# EAGLE board DM04ttl (EAGLE 6.6.0), part 1 of 3
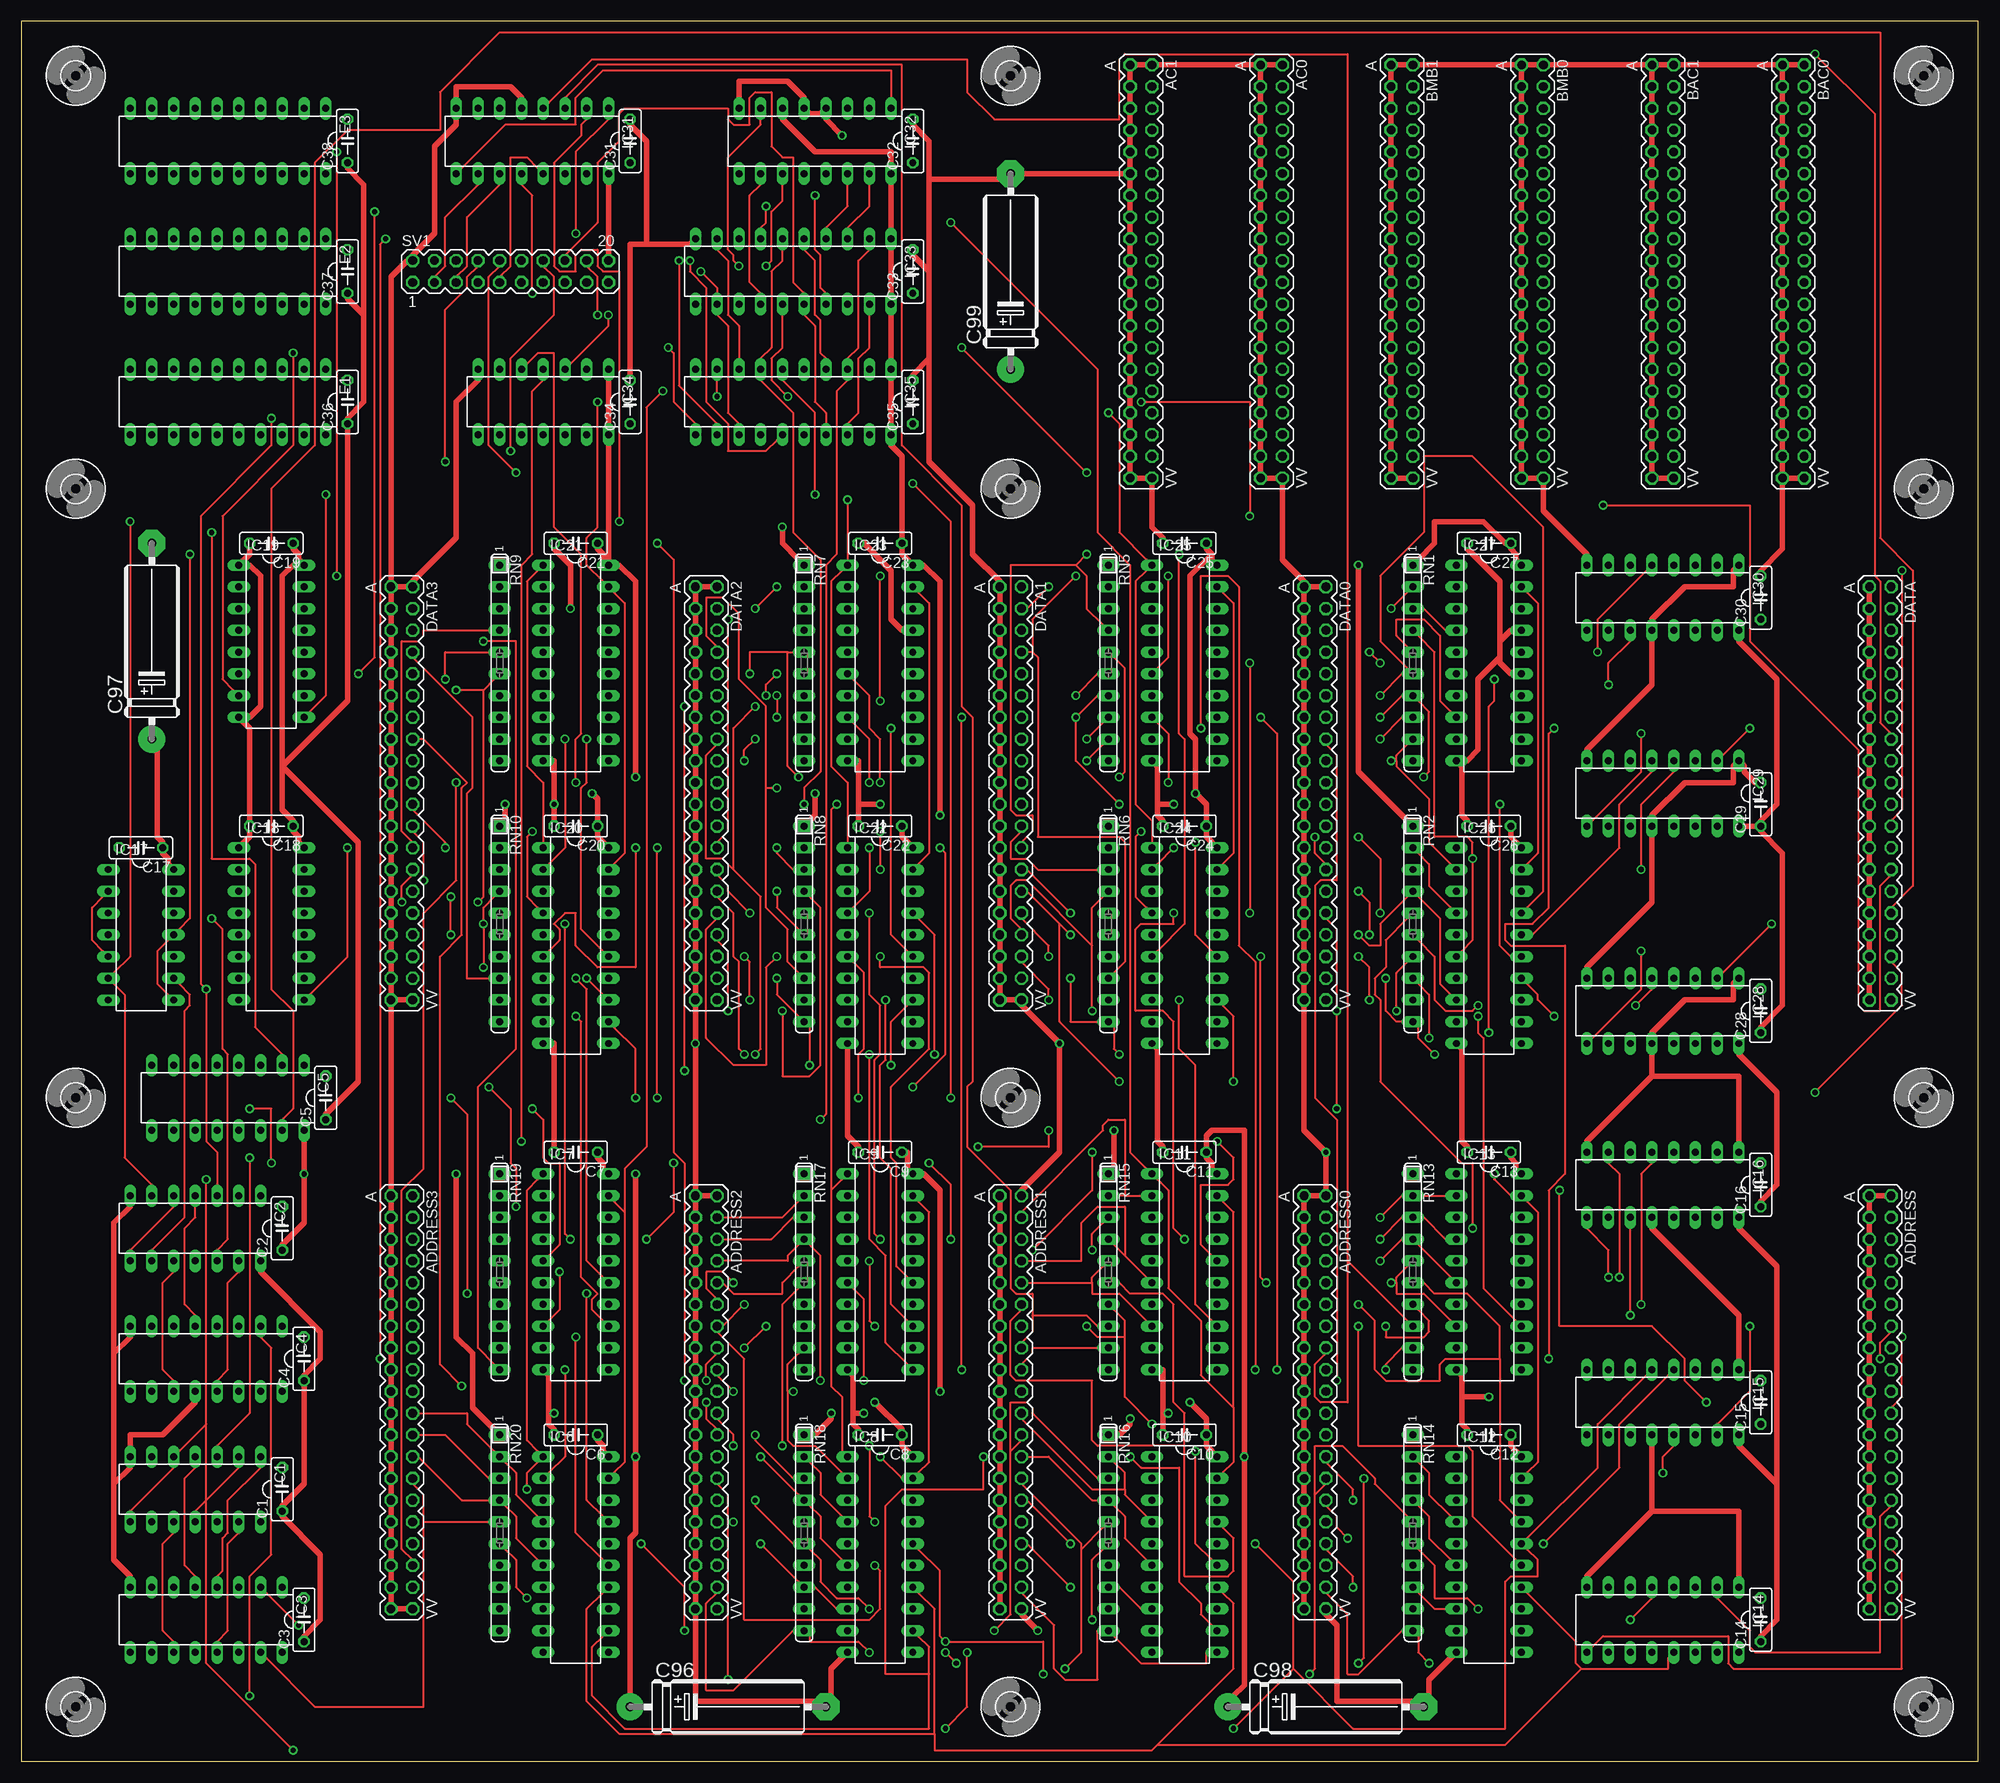
[diagram p6: board, top side]
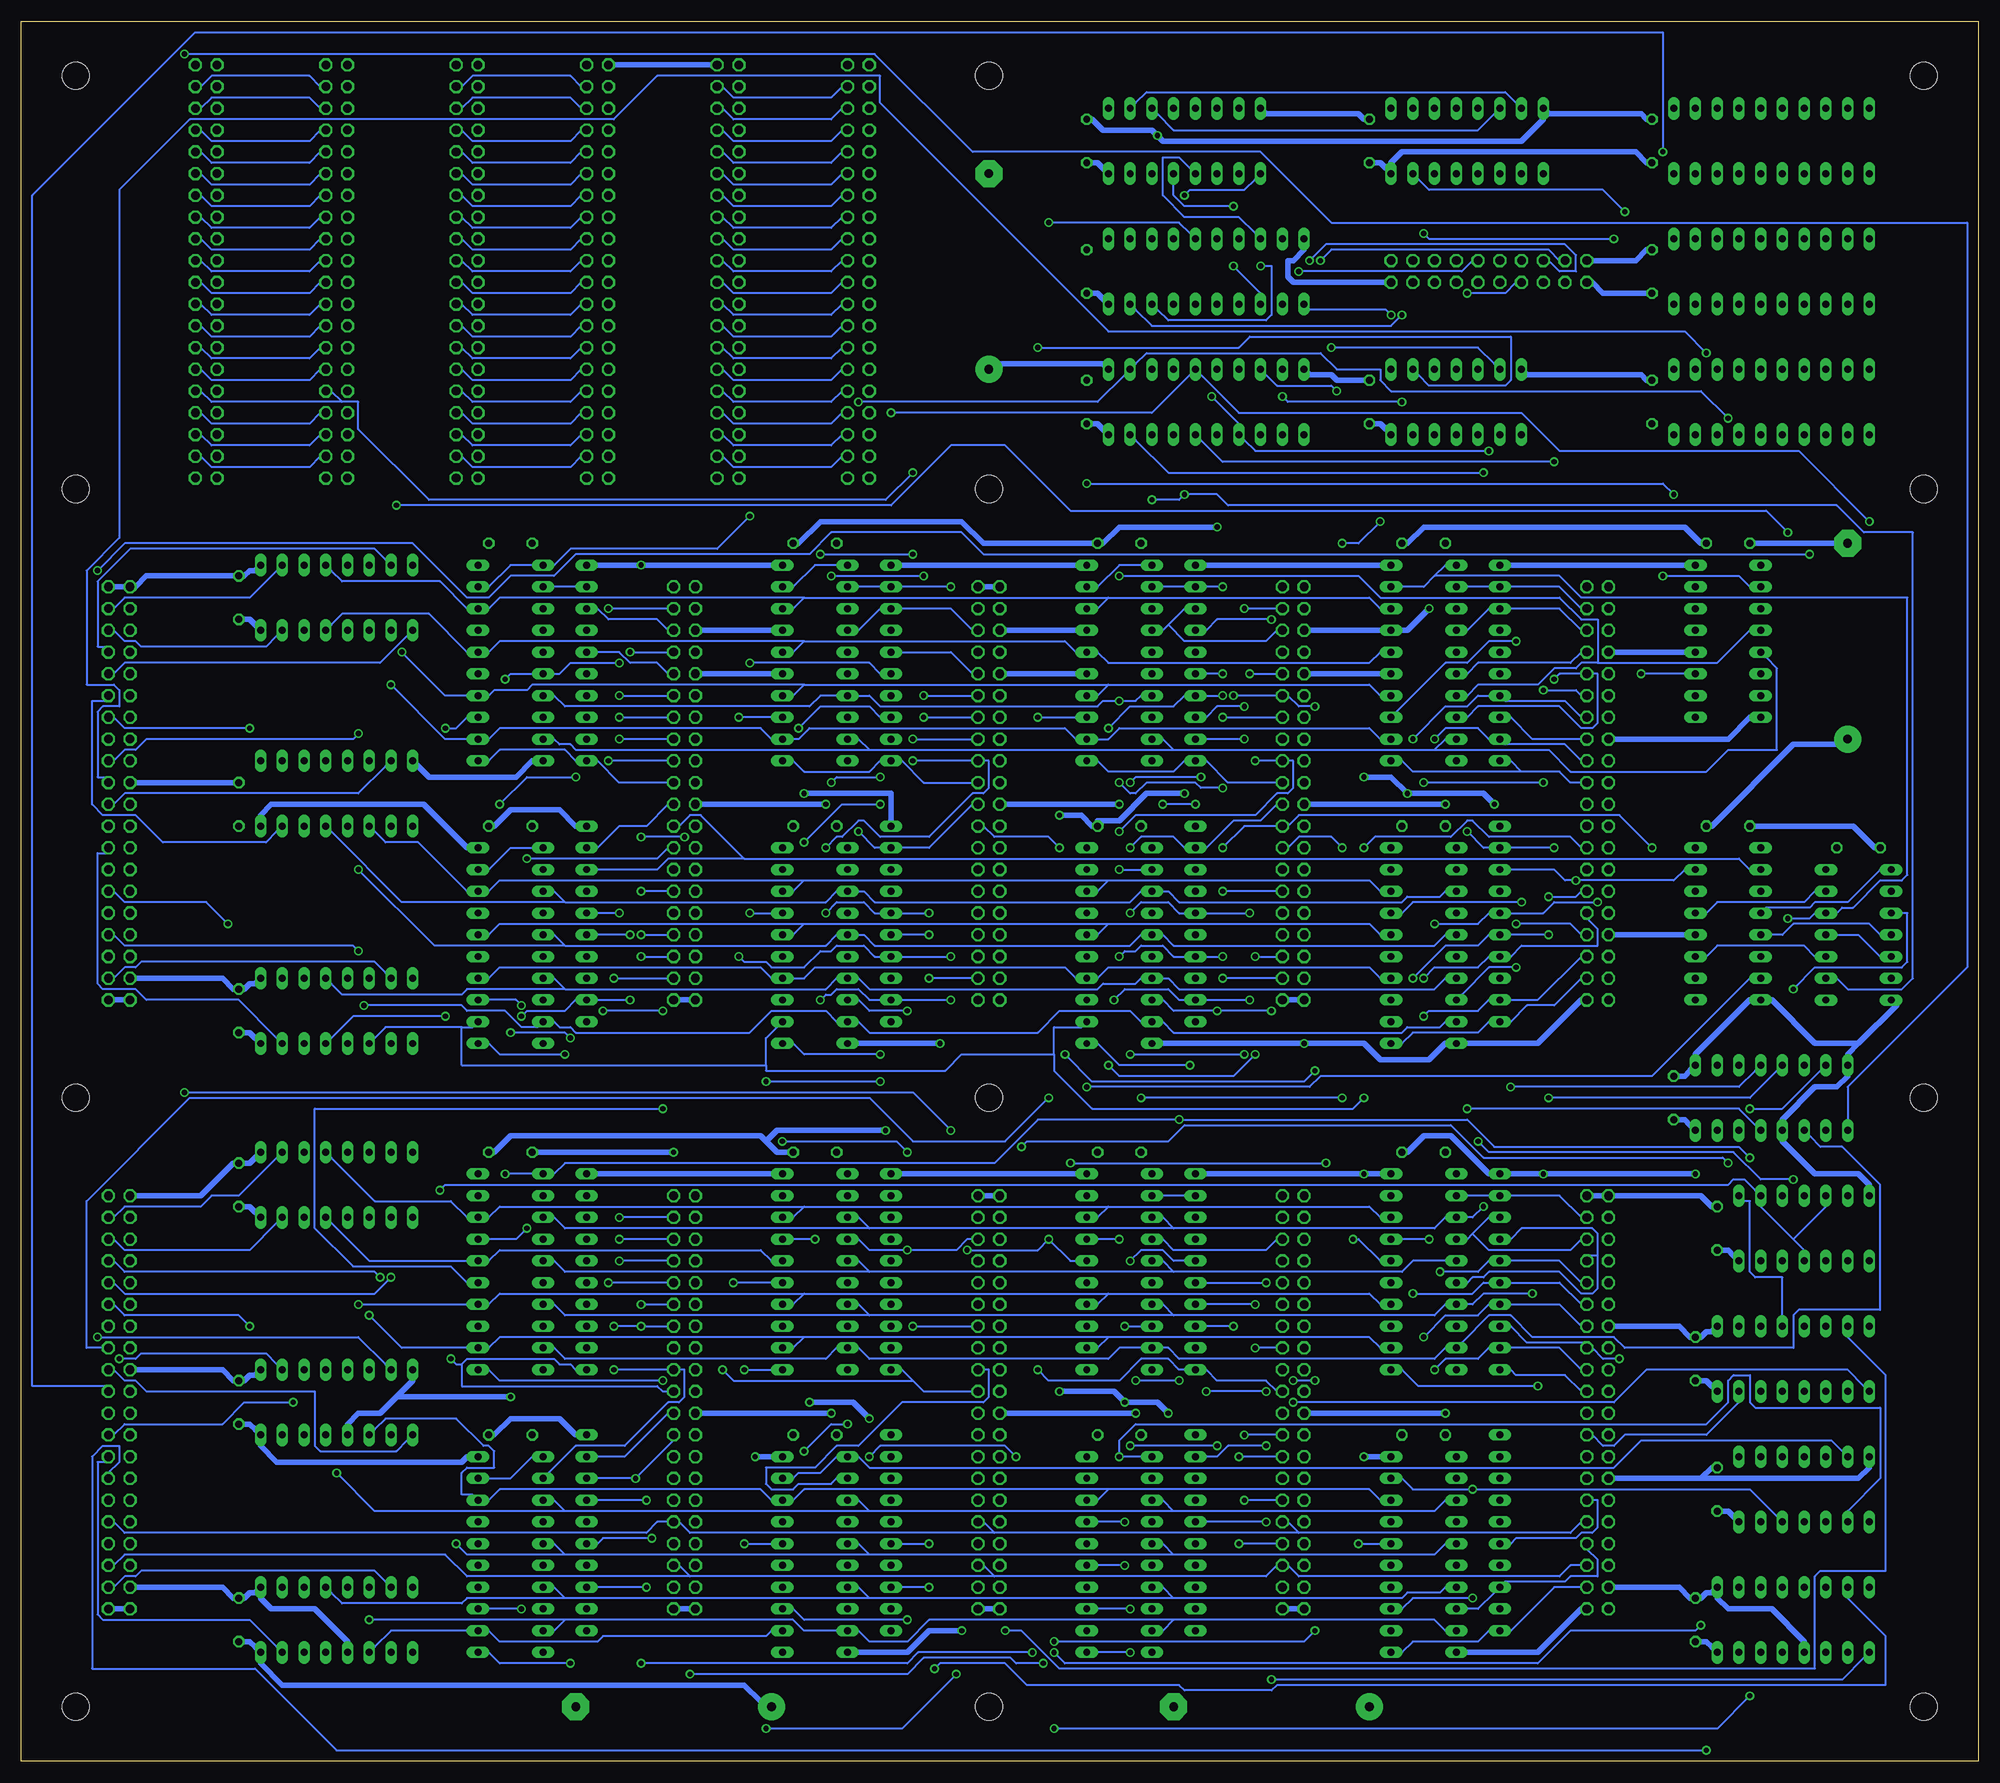
[diagram p7: board, bottom side, seen from below]

Size 228.6 x 203.2 mm. Coordinates in mm from the lower left corner, seen from the top.
Outline: 0,0 228.6,0 228.6,203.2 0,203.2 0,0
Copper layers (1*16): Top 0.035mm / dielectric 1.5mm / Bottom 0.035mm
Design rules "10mils": minimum track width 10mil, minimum drill 24mil, track to track 10mil, track to pad 10mil, pad to pad 10mil, via to via 10mil, smd to smd 10mil, copper to edge 25mil, drill to drill 10mil, minimum pad ring 10mil, minimum via ring 8mil, stop-mask expansion 0mil, vias tented up to drill 0mil, thermal gap 10mil
Net classes: 1 Supply: width 0.635 mm, clearance 0.381 mm

## Footprints (pad centres in the part's own frame; a part is rotated, then mirrored left to right if it is on the bottom)
DEC40PINV = drill 1.016 octagon: A -24.13,-1.27; AA 3.81,-1.27; B -24.13,1.27; BB 3.81,1.27; C -21.59,-1.27; CC 6.35,-1.27; D -21.59,1.27; DD 6.35,1.27; E -19.05,-1.27; EE 8.89,-1.27; F -19.05,1.27; FF 8.89,1.27; H -16.51,-1.27; HH 11.43,-1.27; J -16.51,1.27; JJ 11.43,1.27; K -13.97,-1.27; KK 13.97,-1.27; L -13.97,1.27; LL 13.97,1.27; M -11.43,-1.27; MM 16.51,-1.27; N -11.43,1.27; NN 16.51,1.27; P -8.89,-1.27; PP 19.05,-1.27; R -8.89,1.27; RR 19.05,1.27; S -6.35,-1.27; SS 21.59,-1.27; T -6.35,1.27; TT 21.59,1.27; U -3.81,-1.27; UU 24.13,-1.27; V -3.81,1.27; VV 24.13,1.27; W -1.27,-1.27; X -1.27,1.27; Y 1.27,-1.27; Z 1.27,1.27
C050-025X075 = drill 0.813 octagon: 1 -2.54,0; 2 2.54,0
E22-6 = drill 1.016 pad 3.15: + -11.43,0 | drill 1.016 pad 3.15 octagon: - 11.43,0
DIL20 = drill 0.813 long: 1 -11.43,-3.81; 2 -8.89,-3.81; 3 -6.35,-3.81; 4 -3.81,-3.81; 5 -1.27,-3.81; 6 1.27,-3.81; 7 3.81,-3.81; 8 6.35,-3.81; 9 8.89,-3.81; 10 11.43,-3.81; 11 11.43,3.81; 12 8.89,3.81; 13 6.35,3.81; 14 3.81,3.81; 15 1.27,3.81; 16 -1.27,3.81; 17 -3.81,3.81; 18 -6.35,3.81; 19 -8.89,3.81; 20 -11.43,3.81
DIL14 = drill 0.813 long: 1 -7.62,-3.81; 2 -5.08,-3.81; 3 -2.54,-3.81; 4 0,-3.81; 5 2.54,-3.81; 6 5.08,-3.81; 7 7.62,-3.81; 8 7.62,3.81; 9 5.08,3.81; 10 2.54,3.81; 11 0,3.81; 12 -2.54,3.81; 13 -5.08,3.81; 14 -7.62,3.81
DIL16 = drill 0.813 long: 1 -8.89,-3.81; 2 -6.35,-3.81; 3 -3.81,-3.81; 4 -1.27,-3.81; 5 1.27,-3.81; 6 3.81,-3.81; 7 6.35,-3.81; 8 8.89,-3.81; 9 8.89,3.81; 10 6.35,3.81; 11 3.81,3.81; 12 1.27,3.81; 13 -1.27,3.81; 14 -3.81,3.81; 15 -6.35,3.81; 16 -8.89,3.81
SIL10 = drill 0.813 long: 1 -11.43,0; 2 -8.89,0; 3 -6.35,0; 4 -3.81,0; 5 -1.27,0; 6 1.27,0; 7 3.81,0; 8 6.35,0; 9 8.89,0; 10 11.43,0
MA10-2 = drill 1.016 octagon: 1 -11.43,-1.27; 2 -11.43,1.27; 3 -8.89,-1.27; 4 -8.89,1.27; 5 -6.35,-1.27; 6 -6.35,1.27; 7 -3.81,-1.27; 8 -3.81,1.27; 9 -1.27,-1.27; 10 -1.27,1.27; 11 1.27,-1.27; 12 1.27,1.27; 13 3.81,-1.27; 14 3.81,1.27; 15 6.35,-1.27; 16 6.35,1.27; 17 8.89,-1.27; 18 8.89,1.27; 19 11.43,-1.27; 20 11.43,1.27
3,2 = hole 3.2: 0,0

## Placement (x,y rotation side)
AC0  BC08J  [DEC40PINV]  146.05,173.99 270 top
AC1  BC08J  [DEC40PINV]  130.81,173.99 270 top
ADDRESS  BC08J  [DEC40PINV]  217.17,41.91 270 top
ADDRESS0  BC08J  [DEC40PINV]  151.13,41.91 270 top
ADDRESS1  BC08J  [DEC40PINV]  115.57,41.91 270 top
ADDRESS2  BC08J  [DEC40PINV]  80.01,41.91 270 top
ADDRESS3  BC08J  [DEC40PINV]  44.45,41.91 270 top
BAC0  BC08J  [DEC40PINV]  207.01,173.99 270 top
BAC1  BC08J  [DEC40PINV]  191.77,173.99 270 top
BMB0  BC08J  [DEC40PINV]  176.53,173.99 270 top
BMB1  BC08J  [DEC40PINV]  161.29,173.99 270 top
C1  .1uf  [C050-025X075]  30.48,31.75 90 top
C2  .1uf  [C050-025X075]  30.48,62.23 90 top
C3  .1uf  [C050-025X075]  33.02,16.51 90 top
C4  .1uf  [C050-025X075]  33.02,46.99 90 top
C5  .1uf  [C050-025X075]  35.56,77.47 90 top
C6  .1uf  [C050-025X075]  64.77,38.1 180 top
C7  .1uf  [C050-025X075]  64.77,71.12 180 top
C8  .1uf  [C050-025X075]  100.33,38.1 180 top
C9  .1uf  [C050-025X075]  100.33,71.12 180 top
C10  .1uf  [C050-025X075]  135.89,38.1 180 top
C11  .1uf  [C050-025X075]  135.89,71.12 180 top
C12  .1uf  [C050-025X075]  171.45,38.1 180 top
C13  .1uf  [C050-025X075]  171.45,71.12 180 top
C14  .1uf  [C050-025X075]  203.2,16.51 90 top
C15  .1uf  [C050-025X075]  203.2,41.91 90 top
C16  .1uf  [C050-025X075]  203.2,67.31 90 top
C17  .1uf  [C050-025X075]  13.97,106.68 180 top
C18  .1uf  [C050-025X075]  29.21,109.22 180 top
C19  .1uf  [C050-025X075]  29.21,142.24 180 top
C20  .1uf  [C050-025X075]  64.77,109.22 180 top
C21  .1uf  [C050-025X075]  64.77,142.24 180 top
C22  .1uf  [C050-025X075]  100.33,109.22 180 top
C23  .1uf  [C050-025X075]  100.33,142.24 180 top
C24  .1uf  [C050-025X075]  135.89,109.22 180 top
C25  .1uf  [C050-025X075]  135.89,142.24 180 top
C26  .1uf  [C050-025X075]  171.45,109.22 180 top
C27  .1uf  [C050-025X075]  171.45,142.24 180 top
C28  .1uf  [C050-025X075]  203.2,87.63 90 top
C29  .1uf  [C050-025X075]  203.2,111.76 90 top
C30  .1uf  [C050-025X075]  203.2,135.89 90 top
C31  .1uf  [C050-025X075]  71.12,189.23 90 top
C32  .1uf  [C050-025X075]  104.14,189.23 90 top
C33  .1uf  [C050-025X075]  104.14,173.99 90 top
C34  .1uf  [C050-025X075]  71.12,158.75 90 top
C35  .1uf  [C050-025X075]  104.14,158.75 90 top
C36  .1uf  [C050-025X075]  38.1,158.75 90 top
C37  .1uf  [C050-025X075]  38.1,173.99 90 top
C38  .1uf  [C050-025X075]  38.1,189.23 90 top
C96  100uf  [E22-6]  82.55,6.35 0 top
C97  100uf  [E22-6]  15.24,130.81 90 top
C98  100uf  [E22-6]  152.4,6.35 0 top
C99  100uf  [E22-6]  115.57,173.99 90 top
DATA  BC08J  [DEC40PINV]  217.17,113.03 270 top
DATA0  BC08J  [DEC40PINV]  151.13,113.03 270 top
DATA1  BC08J  [DEC40PINV]  115.57,113.03 270 top
DATA2  BC08J  [DEC40PINV]  80.01,113.03 270 top
DATA3  BC08J  [DEC40PINV]  44.45,113.03 270 top
E1  [DIL20]  24.13,158.75 180 top
E2  [DIL20]  24.13,173.99 180 top
E3  [DIL20]  24.13,189.23 180 top
IC1  74S02N  [DIL14]  20.32,31.75 180 top
IC2  74S02N  [DIL14]  20.32,62.23 180 top
IC3  AM26S10  [DIL16]  21.59,16.51 180 top
IC4  AM26S10  [DIL16]  21.59,46.99 180 top
IC5  AM26S10  [DIL16]  24.13,77.47 180 top
IC6  74S240N  [DIL20]  64.77,24.13 270 top
IC7  74S240N  [DIL20]  64.77,57.15 270 top
IC8  74S240N  [DIL20]  100.33,24.13 270 top
IC9  74S240N  [DIL20]  100.33,57.15 270 top
IC10  74S240N  [DIL20]  135.89,24.13 270 top
IC11  74S240N  [DIL20]  135.89,57.15 270 top
IC12  74S240N  [DIL20]  171.45,24.13 270 top
IC13  74S240N  [DIL20]  171.45,57.15 270 top
IC14  AM26S10  [DIL16]  191.77,16.51 180 top
IC15  AM26S10  [DIL16]  191.77,41.91 180 top
IC16  AM26S10  [DIL16]  191.77,67.31 180 top
IC17  74S02N  [DIL14]  13.97,96.52 270 top
IC18  AM26S10  [DIL16]  29.21,97.79 270 top
IC19  AM26S10  [DIL16]  29.21,130.81 270 top
IC20  74S240N  [DIL20]  64.77,95.25 270 top
IC21  74S240N  [DIL20]  64.77,128.27 270 top
IC22  74S240N  [DIL20]  100.33,95.25 270 top
IC23  74S240N  [DIL20]  100.33,128.27 270 top
IC24  74S240N  [DIL20]  135.89,95.25 270 top
IC25  74S240N  [DIL20]  135.89,128.27 270 top
IC26  74S240N  [DIL20]  171.45,95.25 270 top
IC27  74S240N  [DIL20]  171.45,128.27 270 top
IC28  AM26S10  [DIL16]  191.77,87.63 180 top
IC29  AM26S10  [DIL16]  191.77,113.03 180 top
IC30  AM26S10  [DIL16]  191.77,135.89 180 top
IC31  74LS148N  [DIL16]  59.69,189.23 180 top
IC32  74S138N  [DIL16]  92.71,189.23 180 top
IC33  74273N  [DIL20]  90.17,173.99 180 top
IC34  74S86N  [DIL14]  60.96,158.75 180 top
IC35  74273N  [DIL20]  90.17,158.75 180 top
RN1  [SIL10]  162.56,128.27 270 top
RN2  [SIL10]  162.56,97.79 270 top
RN5  [SIL10]  127,128.27 270 top
RN6  [SIL10]  127,97.79 270 top
RN7  [SIL10]  91.44,128.27 270 top
RN8  [SIL10]  91.44,97.79 270 top
RN9  [SIL10]  55.88,128.27 270 top
RN10  [SIL10]  55.88,97.79 270 top
RN13  [SIL10]  162.56,57.15 270 top
RN14  [SIL10]  162.56,26.67 270 top
RN15  [SIL10]  127,57.15 270 top
RN16  [SIL10]  127,26.67 270 top
RN17  [SIL10]  91.44,57.15 270 top
RN18  [SIL10]  91.44,26.67 270 top
RN19  [SIL10]  55.88,57.15 270 top
RN20  [SIL10]  55.88,26.67 270 top
SV1  [MA10-2]  57.15,173.99 0 top
U$1  [3,2]  222.25,6.35 270 top
U$2  [3,2]  6.35,196.85 270 top
U$3  [3,2]  222.25,196.85 270 top
U$4  [3,2]  6.35,6.35 270 top
U$5  [3,2]  115.57,196.85 270 top
U$6  [3,2]  115.57,77.47 270 top
U$7  [3,2]  222.25,148.59 270 top
U$8  [3,2]  222.25,77.47 270 top
U$9  [3,2]  6.35,77.47 270 top
U$10  [3,2]  6.35,148.59 270 top
U$11  [3,2]  115.57,6.35 270 top
U$12  [3,2]  115.57,148.59 270 top

## Tracks (layer width: path | path; a pad name or v marks a point on that pad's centre or on a via)
1-CA_INH
  Bottom 0.254: 63.5,118.11 62.23,119.38 IC21.9 | 93.98,118.11 63.5,118.11 | 93.98,118.11 95.25,119.38 IC23.9 | 63.5,118.11 50.16,118.11 47.62,115.57 31.75,115.57 29.21,118.11 23.5,118.11 23.5,127.64 24.77,128.91 IC19.5 | 129.54,118.11 130.81,119.38 IC25.9 | 129.54,118.11 93.98,118.11 | 129.54,118.11 163.83,118.11 164.47,118.75 165.74,118.75 166.37,119.38 IC27.9
3CYCLE
  Bottom 0.254: IC13.9 166.37,48.26 165.1,46.99 134.62,46.99 133.35,48.26 IC11.9 130.81,48.26 129.54,46.99 101.6,46.99 100.33,48.26 97.79,48.26 IC9.9 95.25,48.26 94.61,48.26 93.34,46.99 63.5,46.99 62.23,48.26 IC7.9 60.33,48.9 57.15,52.07 54.61,52.07 52.07,49.53 42.55,49.53 41.27,48.26 21.59,48.26 21.59,52.07 20.95,52.7 11.43,52.7 11.43,67.31 15.88,71.75 18.41,71.75 19.68,73.03 IC5.11
!1-CA_INH  (via drill 0.61)
  Top 0.254: v31.75,164.47 31.75,153.67 23.5,145.41 23.5,126.36 24.77,125.09 IC19.7
  Bottom 0.254: v31.75,164.47 34.29,167 101.6,167 128.27,193.68 128.27,196.85 154.31,196.85 159.38,191.77 208.91,191.77 217.17,183.51 217.17,142.88 220.98,139.06 220.98,125.73 217.81,125.73 217.17,125.09 217.17,123.19 219.07,123.19 219.71,122.56 219.71,114.94 218.44,114.94 DATA.X
!1-CA_INH0
  Bottom 0.254: DATA0.X 153.03,114.3 158.75,114.3 161.29,116.84 RN1.10 163.83,116.84 165.1,118.11 172.72,118.11 173.99,116.84 IC27.11
!1-CA_INH1
  Bottom 0.254: DATA1.X 117.47,114.3 123.19,114.3 125.73,116.84 RN5.10 128.27,116.84 129.54,115.57 137.16,115.57 138.43,116.84 IC25.11
!1-CA_INH2
  Bottom 0.254: DATA2.X 81.92,114.3 87.63,114.3 90.17,116.84 RN7.10 92.71,116.84 93.98,115.57 101.6,115.57 102.87,116.84 IC23.11
!1-CA_INH3
  Bottom 0.254: 53.34,115.57 54.61,116.84 RN9.10 | 53.34,115.57 48.9,115.57 47.62,114.3 46.35,114.3 DATA3.X | 53.34,115.57 66.04,115.57 67.31,116.84 IC21.11
!3CYCLE  (via drill 0.61)
  Top 0.254: v209.55,199.39 216.53,192.41 216.53,138.43 217.17,137.79 217.17,121.28 218.44,120.02 DATA.T
  Bottom 0.254: v209.55,199.39 128.91,199.39 117.47,187.96 83.82,187.96 75.56,179.71 1.27,179.71 1.27,92.71 15.24,78.74 15.24,74.93 IC5.9
!3CYCLE0  (via drill 0.61)
  Top 0.254: v158.75,119.38 161.29,121.92 RN1.8 | v153.67,44.45 153.67,74.93 151.13,77.47 151.13,102.23 151.76,102.87 153.67,102.87 153.67,117.47 152.4,118.75 DATA0.T
  Bottom 0.254: v158.75,119.38 153.03,119.38 DATA0.T | v153.67,44.45 172.72,44.45 173.99,45.72 IC13.11
!3CYCLE1  (via drill 0.61)
  Top 0.254: v144.15,45.72 144.15,93.34 142.24,95.25 142.24,137.16 140.97,138.43 137.79,138.43 v137.79,120.65 | v124.46,119.38 126.36,121.28 RN5.8
  Bottom 0.254: v144.15,45.72 140.97,45.72 IC11.11 | v137.79,120.65 135.25,123.19 129.54,123.19 128.27,121.92 RN5.8 | v124.46,119.38 117.47,119.38 DATA1.T
!3CYCLE2  (via drill 0.61)
  Top 0.254: v99.06,82.55 99.06,60.96 100.97,59.05 100.97,48.9 103.5,46.35 IC9.11 | v85.72,82.55 86.36,83.19 86.36,100.97 83.19,104.14 | 83.19,104.14 81.92,105.41 80.01,105.41 80.01,117.47 81.28,118.75 DATA2.T | v85.72,123.19 83.19,120.65 83.19,104.14
  Bottom 0.254: v99.06,82.55 v85.72,82.55 | v85.72,123.19 88.9,123.19 90.17,121.92 RN7.8
!3CYCLE3  (via drill 0.61)
  Top 0.254: v51.44,43.81 48.9,46.35 48.9,93.98 51.44,96.52 51.44,113.67 52.07,114.3 46.99,119.38 46.35,119.38 DATA3.T
  Bottom 0.254: v51.44,43.81 65.41,43.81 67.31,45.72 IC7.11 | RN9.8 54.61,121.92 52.07,119.38 46.35,119.38 DATA3.T
!A_EN0  (via drill 0.61)
  Top 0.254: IC12.19 175.9,33.66 177.16,34.92 177.16,64.14 175.9,65.41 IC13.19 173.99,66.04 172.09,67.94 v172.09,68.58 | IC33.2 99.06,176.53 97.79,175.26 97.79,165.1 96.52,163.83 IC35.3 96.52,161.29 95.25,160.02 95.25,140.97 93.98,139.7 93.98,75.56 v93.34,74.93 | v26.67,70.48 26.67,40.64 22.86,36.83 IC1.3
  Bottom 0.254: IC12.1 168.91,35.56 171.45,33.02 173.99,33.02 IC12.19 | v26.67,70.48 27.94,71.75 56.52,71.75 59.69,74.93 v93.34,74.93 109.86,74.93 114.94,69.85 165.1,69.85 166.37,68.58 IC13.1 168.91,68.58 v172.09,68.58
!A_EN1  (via drill 0.61)
  Top 0.254: IC35.4 93.98,163.83 93.34,164.47 93.34,168.28 92.71,168.91 92.71,175.26 91.44,176.53 IC33.5 | 141.6,41.27 141.6,34.92 140.34,33.66 IC10.19 | 141.6,41.27 141.6,64.14 140.34,65.41 IC11.19 | 141.6,41.27 137.79,45.09 137.79,51.44 133.99,55.24 133.99,66.67 132.72,67.94 IC11.1 131.44,69.22 129.54,71.12 129.54,139.7 125.73,143.51 125.73,162.56 v108.58,179.71
  Bottom 0.254: IC1.6 15.88,36.2 17.14,37.47 39.37,37.47 42.55,34.29 129.54,34.29 130.81,35.56 IC10.1 133.35,35.56 135.25,33.66 137.79,33.66 138.43,33.02 IC10.19 | v108.58,179.71 93.34,179.71 92.08,178.44 IC33.5
!A_EN2  (via drill 0.61)
  Top 0.254: IC9.19 104.78,65.41 106.05,64.14 106.05,34.92 104.78,33.66 IC8.19 102.87,33.02 v100.33,35.56 | IC33.6 88.9,176.53 88.9,175.26 87.63,173.99 87.63,165.1 86.36,163.83 IC35.7 86.36,161.29 90.17,157.48 90.17,143.51 93.34,140.34 93.34,115.57 91.44,113.67 v91.44,111.76 | 94.61,66.67 95.89,67.94 IC9.1 | 94.61,66.67 94.61,43.81 95.89,42.55 95.89,36.2 IC8.1 | v95.25,111.76 94.61,111.12 94.61,66.67
  Bottom 0.254: IC1.9 15.24,29.21 11.43,33.02 11.43,41.27 26.04,41.27 26.67,41.91 26.67,45.09 28.57,45.09 29.21,44.45 29.21,41.91 31.75,39.37 98.42,39.37 100.33,37.47 v100.33,35.56 97.79,35.56 IC8.1 | v91.44,111.76 v95.25,111.76
!A_EN3  (via drill 0.61)
  Top 0.254: IC7.1 60.33,67.94 59.05,66.67 59.05,37.47 60.33,36.2 IC6.1 60.33,34.92 59.05,33.66 v59.05,31.75 | IC33.9 81.28,176.53 82.55,175.26 82.55,168.91 83.82,167.64 83.82,163.83 IC35.8 | 70.48,64.14 69.22,65.41 IC7.19 | 70.48,64.14 70.48,34.92 69.22,33.66 IC6.19 | v74.93,160.02 73.03,158.12 73.03,71.75 70.48,69.22 70.48,64.14
  Bottom 0.254: IC1.12 23.5,28.57 26.67,31.75 v59.05,31.75 66.04,31.75 67.31,33.02 IC6.19 | v74.93,160.02 75.56,160.66 81.92,160.66 83.19,161.93 IC35.8
!A_EN4  (via drill 0.61)
  Top 0.254: IC35.13 83.82,156.21 82.55,157.48 82.55,167.64 81.28,168.91 IC33.12 81.28,171.45 81.28,172.09 v79.38,173.99
  Bottom 0.254: v79.38,173.99 60.33,173.99 59.05,175.26 SV1.12
!A_EN5  (via drill 0.61)
  Top 0.254: v89.53,159.38 87.63,161.29 87.63,163.83 88.9,165.1 88.9,168.91 IC33.15 | v57.15,153.03 57.15,163.83 62.23,168.91 62.23,173.35 60.96,174.62 SV1.14
  Bottom 0.254: v89.53,159.38 86.36,156.21 IC35.14 85.72,154.31 84.45,153.03 v57.15,153.03
!A_EN6
  Top 0.254: IC35.17 93.98,156.21 93.98,157.48 92.71,158.75 92.71,167.64 91.44,168.91 IC33.16 91.44,171.45 90.17,172.72 90.17,187.32 88.9,187.32 87.63,188.59 87.63,194.94 85.72,194.94 85.09,194.31 85.09,191.13 83.19,191.13 82.55,191.77 82.55,193.04 70.48,193.04 69.85,192.41 69.85,189.23 67.31,186.69 67.31,179.71 63.5,175.9 SV1.16
!A_EN7  (via drill 0.61)
  Top 0.254: IC35.18 96.52,156.21 97.79,157.48 97.79,163.83 99.06,165.1 99.06,168.91 IC33.19 | v67.31,168.91 67.31,173.35 66.04,174.62 SV1.18
  Bottom 0.254: v67.31,168.91 68.58,167.64 96.52,167.64 98.42,169.54 IC33.19
!AC_CLEAR
  Bottom 0.254: AC1.BB 132.72,170.18 133.99,168.91 145.41,168.91 146.69,170.18 AC0.BB
!ADD_ACC  (via drill 0.61)
  Top 0.254: IC1.8 12.7,29.21 17.78,34.29 IC1.5 18.41,36.2 21.59,39.37 | 21.59,30.48 25.4,34.29 IC1.2 | 21.59,30.48 20.32,29.21 IC1.11 | v58.42,72.39 58.42,139.7 59.69,140.97 59.69,160.02 60.96,161.29 IC34.4 | 21.59,30.48 21.59,39.37 | 21.59,39.37 v21.59,67.94 | v31.75,1.27 21.59,11.43 21.59,30.48
  Bottom 0.254: v58.42,72.39 57.15,71.12 28.57,71.12 25.4,67.94 v21.59,67.94 | v31.75,1.27 191.77,1.27 201.29,10.79 220.34,10.79 220.34,35.56 219.07,36.83 217.17,36.83 217.17,34.92 218.44,33.66 ADDRESS.FF
!ADD_ACC0  (via drill 0.61)
  Top 0.254: v32.38,15.88 28.57,19.68 IC3.2 | v107.95,12.7 v109.22,11.43 | v150.5,10.16 151.13,10.79 151.13,31.11 | 151.13,31.11 152.4,32.38 ADDRESS0.FF | 151.13,31.11 151.13,36.83 154.31,36.83 158.12,33.02 158.12,32.38 161.93,28.57 RN14.5
  Bottom 0.254: v32.38,15.88 33.02,15.24 47.62,15.24 51.44,11.43 106.68,11.43 v107.95,12.7 | v109.22,11.43 112.39,11.43 113.03,12.06 123.19,12.06 125.09,10.16 v150.5,10.16
!ADD_ACC1  (via drill 0.61)
  Top 0.254: v121.92,10.79 123.83,12.7 123.83,24.77 | 123.83,24.77 126.36,27.3 RN16.5 | 123.83,24.77 123.83,25.4 116.84,32.38 ADDRESS1.FF
  Bottom 0.254: v121.92,10.79 121.28,11.43 113.67,11.43 111.12,8.89 93.34,8.89 92.71,8.26 82.55,8.26 81.92,8.89 10.79,8.89 10.79,14.61 15.24,19.05 IC3.7
!ADD_ACC2  (via drill 0.61)
  Top 0.254: 82.55,27.94 82.55,31.11 81.28,32.38 ADDRESS2.FF | v82.55,9.53 82.55,27.94 | 82.55,27.94 v83.19,27.94
  Bottom 0.254: v82.55,9.53 15.88,9.53 13.34,12.06 IC3.9 | v83.19,27.94 90.17,27.94 RN18.5
!ADD_ACC3
  Top 0.254: 46.99,27.94 46.99,31.11 45.72,32.38 ADDRESS3.FF | 46.99,27.94 46.99,6.35 34.29,6.35 28.57,12.06 IC3.15 | 46.99,27.94 54.61,27.94 RN20.5
!B_EN0  (via drill 0.61)
  Top 0.254: IC2.3 22.86,67.31 22.86,71.12 21.59,72.39 v21.59,90.17 20.95,90.81 20.95,145.41 29.21,153.67 v29.21,156.84 | v130.81,158.75 143.51,158.75 v143.51,145.41 | IC26.19 175.9,104.78 177.16,106.05 177.16,135.25 175.9,136.53 IC27.19
  Bottom 0.254: v21.59,90.17 19.05,92.71 8.89,92.71 8.26,93.34 8.26,99.06 8.89,99.06 IC17.3 | IC26.19 173.99,104.14 171.45,106.68 168.91,106.68 IC26.1 | v130.81,158.75 102.87,158.75 99.69,161.93 IC35.2 98.42,163.19 97.16,164.47 76.83,164.47 74.93,162.56 69.85,162.56 69.85,161.29 68.58,160.02 32.38,160.02 v29.21,156.84 | v143.51,145.41 147.32,141.6 164.47,141.6 166.37,139.7 IC27.1 168.91,139.7 171.45,139.7 173.99,137.16 IC27.19
!B_EN1  (via drill 0.61)
  Top 0.254: IC24.19 140.34,104.78 141.6,106.05 141.6,135.25 140.34,136.53 IC25.19 | IC2.6 15.24,67.31 12.06,70.48 12.06,89.53 10.79,90.81 IC17.6 10.79,92.08 12.7,93.98 v12.7,144.78 | IC24.1 132.08,107.31 132.08,109.86 130.18,111.76 130.18,137.79 131.44,139.06 IC25.1 131.44,140.34 128.27,143.51 128.27,156.21 v127,157.48
  Bottom 0.254: v127,157.48 96.52,157.48 92.08,161.93 IC35.5 90.81,161.93 86.36,157.48 53.34,157.48 48.9,153.03 20.95,153.03 v12.7,144.78 | IC25.19 138.43,137.16 135.89,139.7 133.35,139.7 IC25.1
!B_EN2  (via drill 0.61)
  Top 0.254: IC2.9 15.24,59.69 19.05,63.5 19.05,87.63 19.68,88.27 19.68,89.53 18.41,90.81 IC17.9 | IC22.19 104.78,104.78 106.05,106.05 106.05,135.25 104.78,136.53 IC23.19 | IC22.1 96.52,107.31 96.52,114.3 94.61,116.2 94.61,137.79 95.89,139.06 IC23.1 96.52,140.34 v96.52,147.32 | v92.71,147.96 92.71,157.48 88.9,161.29 IC35.6
  Bottom 0.254: v96.52,147.32 93.34,147.32 v92.71,147.96 88.9,147.96 87.63,146.69 16.51,146.69 13.34,143.51 7.62,143.51 7.62,91.44 8.89,90.17 15.24,90.17 16.51,91.44 IC17.9 | IC23.19 102.87,137.16 100.33,139.7 97.79,139.7 IC23.1
!B_EN3  (via drill 0.61)
  Top 0.254: v22.23,98.42 23.5,97.16 23.5,83.19 24.13,82.55 24.13,60.96 22.86,59.69 IC2.12 | IC20.1 60.96,107.31 60.96,114.3 59.05,116.2 59.05,137.79 60.33,139.06 IC21.1 | IC20.19 69.22,104.78 70.48,106.05 70.48,135.25 69.22,136.53 IC21.19 67.94,137.79 66.04,139.7 66.04,142.88 67.31,144.15 v67.31,158.75 | v81.28,159.38 81.28,161.29 IC35.9
  Bottom 0.254: v22.23,98.42 19.68,98.42 19.05,99.06 IC17.12 16.51,99.06 15.88,99.69 14.61,99.69 11.43,102.87 8.89,102.87 8.26,103.5 8.26,135.89 46.35,135.89 48.9,138.43 63.5,138.43 | v81.28,159.38 80.64,158.75 v67.31,158.75 | 63.5,138.43 64.77,137.16 67.31,137.16 IC21.19 | 63.5,138.43 62.23,139.7 IC21.1
!B_EN4  (via drill 0.61)
  Top 0.254: v76.83,175.26 76.83,160.66 81.28,156.21 IC35.12
  Bottom 0.254: v76.83,175.26 75.56,176.53 50.16,176.53 48.9,175.26 SV1.4
!B_EN5  (via drill 0.61)
  Top 0.254: v78.11,175.26 78.11,173.99 80.01,172.09 80.01,158.75 82.55,156.21 82.55,153.03 87,153.03 88.27,154.31 IC35.15
  Bottom 0.254: v78.11,175.26 76.2,177.16 48.26,177.16 46.99,175.9 46.99,173.99 48.9,173.99 50.16,175.26 SV1.6
!B_EN6  (via drill 0.61)
  Top 0.254: v49.53,151.76 49.53,169.54 52.07,172.09 52.07,173.35 53.34,174.62 SV1.8
  Bottom 0.254: v49.53,151.76 88.27,151.76 90.81,154.31 IC35.16
!B_EN7  (via drill 0.61)
  Top 0.254: v57.78,150.5 54.61,153.67 54.61,173.35 55.88,174.62 SV1.10
  Bottom 0.254: v57.78,150.5 94.61,150.5 98.42,154.31 IC35.19
!BMB0
  Bottom 0.254: BMB1.F 163.19,193.04 164.47,194.31 175.9,194.31 177.16,193.04 BMB0.F
!BMB1
  Bottom 0.254: BMB1.L 163.19,187.96 164.47,186.69 175.9,186.69 177.16,187.96 BMB0.L
!BMB2
  Bottom 0.254: BMB1.R 163.19,182.88 164.47,181.61 175.9,181.61 177.16,182.88 BMB0.R
!BMB3
  Bottom 0.254: BMB1.Z 163.19,172.72 164.47,171.45 175.9,171.45 177.16,172.72 BMB0.Z
!BMB4
  Bottom 0.254: BMB1.JJ 163.19,162.56 164.47,161.29 175.9,161.29 177.16,162.56 BMB0.JJ
!BMB5
  Bottom 0.254: BMB1.TT 163.19,152.4 164.47,151.13 175.9,151.13 177.16,152.4 BMB0.TT
!BMB6
  Bottom 0.254: BMB1.J 163.19,190.5 164.47,189.23 175.9,189.23 177.16,190.5 BMB0.J
!BMB7
  Bottom 0.254: BMB1.T 163.19,180.34 164.47,179.07 175.9,179.07 177.16,180.34 BMB0.T
!BMB8
  Bottom 0.254: BMB1.BB 163.19,170.18 164.47,168.91 175.9,168.91 177.16,170.18 BMB0.BB
!BMB9
  Bottom 0.254: BMB1.FF 163.19,165.1 164.47,163.83 175.9,163.83 177.16,165.1 BMB0.FF
!BMB10
  Bottom 0.254: BMB1.LL 163.19,160.02 164.47,158.75 175.9,158.75 177.16,160.02 BMB0.LL
!BMB11
  Bottom 0.254: BMB1.RR 163.19,154.94 164.47,153.67 175.9,153.67 177.16,154.94 BMB0.RR
!BREAK  (via drill 0.61)
  Top 0.254: IC2.8 12.7,59.69 17.78,64.77 IC2.5 | v196.85,41.91 194.31,44.45 194.31,46.99 190.5,50.8 179.71,50.8 v179.71,66.67
  Bottom 0.254: 21.59,60.96 25.4,64.77 IC2.2 26.04,66.67 27.3,67.94 28.57,67.94 29.21,67.31 179.07,67.31 v179.71,66.67 | 21.59,60.96 20.32,59.69 IC2.11 | v196.85,41.91 202.56,41.91 205.1,39.37 216.53,39.37 217.81,38.1 ADDRESS.BB | 21.59,60.96 17.78,64.77 IC2.5
!BREAK0  (via drill 0.61)
  Top 0.254: v26.67,7.62 26.67,21.59 29.21,24.13 29.21,48.26 27.94,49.53 IC4.2 | v107.95,3.81 110.49,6.35 v110.49,12.7 | v156.21,11.43 156.84,12.06 v156.84,33.02
  Bottom 0.254: v26.67,7.62 30.48,3.81 v107.95,3.81 | v110.49,12.7 123.83,12.7 125.09,11.43 v156.21,11.43 | RN14.3 161.29,33.02 v156.84,33.02 152.4,37.47 ADDRESS0.BB
!BREAK1  (via drill 0.61)
  Top 0.254: v113.67,15.24 115.57,17.14 115.57,36.2 | 115.57,36.2 116.84,37.47 ADDRESS1.BB | 115.57,36.2 115.57,41.91 117.47,41.91 118.11,41.27 118.11,40.64 125.73,33.02 RN16.3
  Bottom 0.254: v113.67,15.24 111.76,15.24 107.31,10.79 19.05,10.79 19.05,21.59 18.41,22.23 10.79,22.23 10.79,45.09 15.24,49.53 IC4.7
!BREAK2  (via drill 0.61)
  Top 0.254: v80.01,41.91 80.01,40.01 81.28,38.73 ADDRESS2.BB | v85.72,38.1 85.72,37.47 90.17,33.02 RN18.3
  Bottom 0.254: v80.01,41.91 42.55,41.91 38.73,45.72 15.24,45.72 13.34,43.81 IC4.9 | v85.72,38.1 81.92,38.1 ADDRESS2.BB
!BREAK3
  Top 0.254: RN20.3 54.61,33.02 49.53,38.1 46.35,38.1 ADDRESS3.BB
  Bottom 0.254: IC4.15 27.94,41.91 31.75,38.1 41.27,38.1 42.55,36.83 43.81,36.83 45.09,38.1 ADDRESS3.BB
!BRK_REQ  (via drill 0.61)
  Top 0.254: v35.56,147.96 35.56,124.46 33.66,122.56 IC19.9 | v104.14,149.22 108.58,144.78 v108.58,77.47
  Bottom 0.254: v35.56,147.96 36.83,149.22 v104.14,149.22 | v108.58,77.47 113.67,72.39 124.46,72.39 129.54,77.47 208.91,77.47 220.98,65.41 220.98,48.26 219.07,48.26 ADDRESS.T
!BRK_REQ0
  Top 0.254: 154.94,58.42 154.94,199.39 128.91,199.39 128.27,198.75 128.27,191.77 113.67,191.77 110.49,194.94 110.49,198.75 66.67,198.75 61.59,193.68 IC31.4 | 154.94,58.42 161.93,51.44 RN13.8 | 154.94,58.42 154.94,41.91 151.76,41.91 151.13,42.55 151.13,46.35 152.4,47.62 ADDRESS0.T
!BRK_REQ1
  Top 0.254: 118.11,52.07 118.11,50.16 116.84,48.9 ADDRESS1.T | 118.11,52.07 118.11,54.61 116.2,54.61 115.57,55.24 115.57,66.67 110.49,71.75 110.49,78.74 111.12,79.38 111.12,121.92 109.86,123.19 109.86,146.69 102.87,153.67 102.87,198.12 67.31,198.12 63.5,194.31 IC31.3 | 118.11,52.07 124.46,52.07 125.73,50.8 RN15.8
!BRK_REQ2  (via drill 0.61)
  Top 0.254: v69.85,144.78 69.85,173.99 67.94,173.99 67.31,174.62 67.31,176.53 65.41,176.53 64.77,175.9 64.77,173.99 62.87,173.99 62.23,174.62 62.23,186.69 65.41,189.87 65.41,191.13 66.04,191.77 IC31.2 | v74.3,142.24 76.2,140.34 76.2,71.12 77.47,69.85 v77.47,44.45 | v80.01,44.45 80.01,46.35 81.28,47.62 ADDRESS2.T | v84.45,48.26 v87,50.8
  Bottom 0.254: v69.85,144.78 72.39,142.24 v74.3,142.24 | v77.47,44.45 v80.01,44.45 | v87,50.8 90.17,50.8 RN17.8 | v84.45,48.26 81.92,48.26 ADDRESS2.T
!BRK_REQ3  (via drill 0.61)
  Top 0.254: v64.77,178.44 64.77,187.96 68.58,191.77 IC31.1 | v42.55,177.8 41.91,177.16 v41.91,46.99
  Bottom 0.254: RN19.8 54.61,50.8 52.7,48.9 45.72,48.9 ADDRESS3.T 45.09,48.26 43.81,46.99 v41.91,46.99 | v64.77,178.44 64.14,177.8 v42.55,177.8
!BRK_REQ4
  Top 0.254: IC31.13 60.33,186.06 59.05,187.32 57.15,187.32 57.15,174.62 55.88,173.35 SV1.9
!BRK_REQ5  (via drill 0.61)
  Top 0.254: v59.69,171.45 59.69,182.88 58.42,184.15 IC31.12
  Bottom 0.254: v59.69,171.45 55.24,171.45 53.98,172.72 SV1.7
!BRK_REQ6
  Top 0.254: IC31.11 55.88,184.15 52.07,180.34 52.07,174.62 50.8,173.35 SV1.5
!BRK_REQ7
  Top 0.254: IC31.10 53.34,184.15 49.53,180.34 49.53,174.62 48.26,173.35 SV1.3
!DA0
  Bottom 0.254: IC16.15 198.75,62.87 201.93,59.69 216.53,59.69 217.81,60.96 ADDRESS.F
!DA0-0  (via drill 0.61)
  Top 0.254: IC13.4 166.37,60.96 163.83,63.5 RN13.3 161.29,63.5 v158.75,60.96
  Bottom 0.254: v158.75,60.96 153.03,60.96 ADDRESS0.F
!DA0-1  (via drill 0.61)
  Top 0.254: v125.09,59.69 125.09,61.59 126.36,62.87 RN15.3
  Bottom 0.254: IC11.4 130.81,60.96 129.54,59.69 v125.09,59.69 119.38,59.69 118.11,60.96 117.47,60.96 ADDRESS1.F
!DA0-2
  Top 0.254: RN17.3 90.17,63.5 87.63,60.96 81.92,60.96 ADDRESS2.F
  Bottom 0.254: IC9.4 95.25,60.96 93.98,59.69 83.19,59.69 81.92,60.96 ADDRESS2.F
!DA0-3
  Bottom 0.254: 59.05,61.59 57.15,63.5 RN19.3 | 59.05,61.59 59.69,60.96 IC7.4 | 59.05,61.59 57.15,59.69 47.62,59.69 46.35,60.96 ADDRESS3.F
!DA1  (via drill 0.61)
  Top 0.254: v185.42,56.52 185.42,59.69 182.88,62.23 IC16.9
  Bottom 0.254: v185.42,56.52 187.32,54.61 216.53,54.61 217.81,55.88 ADDRESS.L
!DA1-0  (via drill 0.61)
  Top 0.254: 160.66,55.88 160.66,56.52 161.93,57.78 RN13.5 | 160.66,55.88 160.66,54.61 163.83,54.61 167,51.44 IC13.8 | v160.02,55.88 160.66,55.88
  Bottom 0.254: v160.02,55.88 153.03,55.88 ADDRESS0.L
!DA1-1
  Top 0.254: 125.09,55.88 125.09,56.52 126.36,57.78 RN15.5 | 125.09,55.88 125.09,54.61 128.27,54.61 131.44,51.44 IC11.8 | 125.09,55.88 117.47,55.88 ADDRESS1.L
!DA1-2  (via drill 0.61)
  Top 0.254: v99.69,50.8 99.06,51.44 v99.06,58.42 | ADDRESS2.L 81.92,55.88 83.19,54.61 88.9,54.61 88.9,55.88 90.81,57.78 RN17.5
  Bottom 0.254: v99.69,50.8 97.79,50.8 IC9.8 | v99.06,58.42 97.79,59.69 95.25,59.69 93.98,58.42 92.71,58.42 RN17.5
!DA1-3  (via drill 0.61)
  Top 0.254: v62.87,57.15 62.87,52.7 61.59,51.44 IC7.8
  Bottom 0.254: v62.87,57.15 58.42,57.15 57.15,58.42 RN19.5 54.61,58.42 48.9,58.42 46.35,55.88 ADDRESS3.L
!DA2  (via drill 0.61)
  Top 0.254: v217.17,46.99 217.17,48.9 218.44,50.16 ADDRESS.R
  Bottom 0.254: v217.17,46.99 215.26,46.99 214.63,47.62 200.03,47.62 198.75,46.35 IC15.2
!DA2-0  (via drill 0.61)
  Top 0.254: v156.21,50.8 156.21,36.83 168.91,36.83 169.54,36.2 169.54,28.57 174.62,23.5 IC12.15 | v159.38,50.8 159.38,49.53 163.83,49.53 164.47,50.16 164.47,51.44 163.19,52.7 RN13.7
  Bottom 0.254: ADDRESS0.R 153.03,50.8 v156.21,50.8 v159.38,50.8
!DA2-1  (via drill 0.61)
  Top 0.254: v137.16,36.2 137.16,25.4 139.06,23.5 IC10.15 | v132.08,39.37 128.91,42.55 128.91,49.53 | 128.91,49.53 128.91,51.44 127.64,52.7 RN15.7 | v124.46,50.8 125.73,49.53 128.91,49.53
  Bottom 0.254: v137.16,36.2 133.99,39.37 v132.08,39.37 | v124.46,50.8 117.47,50.8 ADDRESS1.R
!DA2-2  (via drill 0.61)
  Top 0.254: v99.69,22.86 100.33,22.23 100.33,17.78 99.06,16.51 84.45,16.51 84.45,46.99 81.28,50.16 ADDRESS2.R 81.92,50.8 v84.45,53.34
  Bottom 0.254: v99.69,22.86 102.87,22.86 IC8.15 | v84.45,53.34 90.17,53.34 RN17.7
!DA2-3  (via drill 0.61)
  Top 0.254: v64.77,49.53 64.77,26.67 67.94,23.5 IC6.15
  Bottom 0.254: v64.77,49.53 62.23,52.07 58.42,52.07 57.15,53.34 RN19.7 54.61,53.34 48.9,53.34 46.35,50.8 ADDRESS3.R
!DA3
  Bottom 0.254: IC15.9 183.51,37.47 184.78,36.2 193.68,36.2 194.31,36.83 194.31,43.18 214,43.18 215.26,44.45 216.53,44.45 217.81,45.72 ADDRESS.V
!DA3-0  (via drill 0.61)
  Top 0.254: v159.38,45.72 159.38,46.35 161.29,48.26 RN13.9
  Bottom 0.254: IC12.2 167,33.66 163.83,36.83 158.12,36.83 153.03,41.91 151.76,41.91 151.13,42.55 151.13,45.72 151.76,45.72 ADDRESS0.V 153.03,45.72 v159.38,45.72
!DA3-1
  Top 0.254: RN15.9 125.73,48.26 118.11,48.26 118.11,47.62 116.84,46.35 ADDRESS1.V
  Bottom 0.254: IC10.2 133.35,33.02 133.99,32.38 137.79,32.38 138.43,31.75 140.97,31.75 141.6,32.38 141.6,34.29 135.89,34.29 133.35,36.83 130.81,36.83 125.73,41.91 116.2,41.91 115.57,42.55 115.57,45.72 116.2,45.72 ADDRESS1.V
!DA3-2  (via drill 0.61)
  Top 0.254: 89.53,43.18 89.53,46.35 90.81,47.62 RN17.9 | 89.53,43.18 89.53,37.47 90.17,36.83 92.71,36.83 95.89,33.66 IC8.2 | v83.19,43.18 81.28,45.09 ADDRESS2.V | v90.17,43.18 89.53,43.18
  Bottom 0.254: v83.19,43.18 v90.17,43.18
!DA3-3  (via drill 0.61)
  Top 0.254: v63.5,45.72 63.5,35.56 61.59,33.66 IC6.2
  Bottom 0.254: v63.5,45.72 62.23,46.99 58.42,46.99 57.15,48.26 RN19.9 54.61,48.26 48.9,48.26 46.35,45.72 ADDRESS3.V
!DA4  (via drill 0.61)
  Top 0.254: v219.71,49.53 219.71,42.55 218.44,41.27 ADDRESS.Z
  Bottom 0.254: v219.71,49.53 189.23,49.53 186.06,46.35 IC15.7
!DA4-0
  Top 0.254: IC12.4 167,28.57 164.47,31.11 164.47,33.66 163.19,34.92 RN14.2
  Bottom 0.254: ADDRESS0.Z 153.03,40.64 158.12,35.56 161.29,35.56 RN14.2
!DA4-1
  Top 0.254: 128.91,31.75 128.91,33.66 127.64,34.92 RN16.2 | 128.91,31.75 128.91,31.11 131.44,28.57 IC10.4 | 128.91,31.75 125.09,31.75 116.84,40.01 ADDRESS1.Z
!DA4-2  (via drill 0.61)
  Top 0.254: IC8.4 95.89,28.57 93.34,31.11 93.34,33.66 92.08,34.92 RN18.2 | v83.19,36.83 83.19,38.1 81.28,40.01 ADDRESS2.Z
  Bottom 0.254: v83.19,36.83 87.63,36.83 88.9,35.56 90.17,35.56 RN18.2
!DA4-3
  Top 0.254: IC6.4 60.33,28.57 57.78,31.11 57.78,33.66 56.52,34.92 RN20.2 55.24,36.2 52.07,39.37 52.07,40.64 46.35,40.64 ADDRESS3.Z
!DA5
  Bottom 0.254: IC14.15 198.75,13.34 201.93,16.51 219.07,16.51 219.71,17.14 219.71,34.92 218.44,34.92 ADDRESS.DD
!DA5-0  (via drill 0.61)
  Top 0.254: IC12.6 167,23.5 164.47,26.04 164.47,28.57 163.19,29.84 RN14.4 | v155.57,30.48 155.57,31.75 152.4,34.92 ADDRESS0.DD
  Bottom 0.254: v155.57,30.48 161.29,30.48 RN14.4
!DA5-1
  Top 0.254: IC10.6 131.44,23.5 128.91,26.04 128.91,28.57 127.64,29.84 RN16.4 125.73,30.48 125.09,30.48 120.02,35.56 117.47,35.56 ADDRESS1.DD
!DA5-2  (via drill 0.61)
  Top 0.254: IC8.6 95.89,23.5 93.34,26.04 93.34,28.57 92.08,29.84 RN18.4 90.81,31.11 v86.36,35.56
  Bottom 0.254: v86.36,35.56 81.92,35.56 ADDRESS2.DD
!DA5-3
  Top 0.254: IC6.6 60.33,23.5 57.78,26.04 57.78,28.57 56.52,29.84 RN20.4 54.61,30.48 51.44,30.48 46.35,35.56 ADDRESS3.DD
!DA6
  Top 0.254: IC14.2 198.12,19.05 201.93,15.24 201.93,13.34 202.56,12.7 217.17,12.7 217.17,28.57 218.44,29.84 ADDRESS.JJ
!DA6-0  (via drill 0.61)
  Top 0.254: v154.94,26.04 153.67,27.3 153.67,28.57 152.4,29.84 ADDRESS0.JJ | v170.18,17.78 168.91,19.05 165.1,19.05 165.1,22.86 163.19,24.77 RN14.6
  Bottom 0.254: v154.94,26.04 160.66,26.04 161.29,25.4 RN14.6 | v170.18,17.78 173.99,17.78 IC12.13
!DA6-1  (via drill 0.61)
  Top 0.254: v122.56,25.4 117.47,30.48 ADDRESS1.JJ | v125.09,16.51 125.09,23.5 126.36,24.77 RN16.6
  Bottom 0.254: v122.56,25.4 125.73,25.4 RN16.6 | v125.09,16.51 137.16,16.51 138.43,17.78 IC10.13
!DA6-2  (via drill 0.61)
  Top 0.254: v85.72,30.48 85.72,29.84 90.17,25.4 RN18.6 92.08,24.77 93.34,23.5 93.34,20.95 95.25,19.05 97.79,19.05 v99.06,17.78
  Bottom 0.254: v85.72,30.48 81.92,30.48 ADDRESS2.JJ | v99.06,17.78 102.87,17.78 IC8.13
!DA6-3  (via drill 0.61)
  Top 0.254: v59.05,19.05 57.78,20.32 57.78,23.5 56.52,24.77 RN20.6
  Bottom 0.254: RN20.6 54.61,25.4 53.98,26.04 46.99,26.04 46.35,26.67 45.09,26.67 44.45,27.3 44.45,30.48 45.09,30.48 ADDRESS3.JJ | v59.05,19.05 66.04,19.05 67.31,17.78 IC6.13
!DA7
  Top 0.254: IC14.9 183.51,13.34 184.78,14.61 199.39,14.61 199.39,11.43 200.03,10.79 219.71,10.79 219.71,23.5 218.44,24.77 ADDRESS.NN
!DA7-0  (via drill 0.61)
  Top 0.254: RN14.8 163.19,19.68 165.1,17.78 166.37,17.78 IC12.8 | v155.57,20.32 155.57,21.59 152.4,24.77 ADDRESS0.NN
  Bottom 0.254: v155.57,20.32 161.29,20.32 RN14.8
!DA7-1  (via drill 0.61)
  Top 0.254: RN16.8 128.27,20.32 130.81,17.78 IC10.8 | v122.56,20.32 117.47,25.4 ADDRESS1.NN
  Bottom 0.254: v122.56,20.32 125.73,20.32 RN16.8
!DA7-2  (via drill 0.61)
  Top 0.254: IC8.8 95.25,17.78 92.71,20.32 RN18.8 90.81,20.95 v86.36,25.4
  Bottom 0.254: v86.36,25.4 81.92,25.4 ADDRESS2.NN
!DA7-3
  Bottom 0.254: IC6.8 59.69,17.78 58.42,17.78 56.52,19.68 RN20.8 55.24,20.95 48.26,20.95 47.62,21.59 44.45,21.59 44.45,23.5 45.72,24.77 ADDRESS3.NN
!DA8
  Bottom 0.254: IC14.7 186.06,20.95 187.32,22.23 214.63,22.23 215.26,21.59 216.53,21.59 217.81,20.32 ADDRESS.TT
!DA8-0  (via drill 0.61)
  Top 0.254: ADDRESS0.TT 152.4,19.68 154.94,17.14 154.94,10.16 156.21,10.16 161.29,15.24 RN14.10 163.19,14.61 163.19,12.7 v164.47,11.43
  Bottom 0.254: v164.47,11.43 172.72,11.43 173.99,12.7 IC12.11
!DA8-1
  Top 0.254: IC10.11 138.43,12.7 138.43,11.43 130.81,11.43 127.64,14.61 RN16.10 125.73,15.24 125.73,9.53 121.92,9.53 120.65,10.79 120.65,15.88 116.84,19.68 ADDRESS1.TT
!DA8-2  (via drill 0.61)
  Top 0.254: ADDRESS2.TT 81.28,19.68 80.01,18.41 80.01,8.26 83.19,8.26 90.17,15.24 RN18.10 92.08,14.61 92.08,13.97 97.79,13.97 v99.06,12.7
  Bottom 0.254: v99.06,12.7 102.87,12.7 IC8.11
!DA8-3
  Bottom 0.254: ADDRESS3.TT 46.35,20.32 49.53,20.32 54.61,15.24 RN20.10 57.15,15.24 58.42,13.97 66.04,13.97 67.31,12.7 IC6.11
!DA9
  Bottom 0.254: IC16.2 198.75,70.48 203.2,66.04 206.38,66.04 207.65,64.77 216.53,64.77 217.81,63.5 ADDRESS.D
!DA9-0  (via drill 0.61)
  Top 0.254: IC13.2 166.37,66.04 163.83,66.04 RN13.2 161.29,66.04 v158.75,63.5
  Bottom 0.254: v158.75,63.5 153.03,63.5 ADDRESS0.D
!DA9-1
  Top 0.254: 128.91,66.04 130.81,66.04 IC11.2 | 128.91,66.04 128.27,66.04 RN15.2 | 128.91,66.04 128.91,74.93 127,74.93 126.36,74.3 126.36,73.66 116.84,64.14 ADDRESS1.D
!DA9-2
  Top 0.254: ADDRESS2.D 81.92,63.5 88.9,63.5 90.81,65.41 RN17.2
  Bottom 0.254: RN17.2 92.71,66.04 95.25,66.04 IC9.2
!DA9-3
  Bottom 0.254: IC7.2 59.69,66.04 57.15,66.04 RN19.2 54.61,66.04 48.9,66.04 46.35,63.5 ADDRESS3.D
!DA10  (via drill 0.61)
  Top 0.254: v186.69,56.52 186.69,68.58 185.42,69.85 IC16.7
  Bottom 0.254: v186.69,56.52 187.32,57.15 216.53,57.15 217.81,58.42 ADDRESS.J
!DA10-0  (via drill 0.61)
  Top 0.254: IC13.6 167,56.52 163.19,60.33 RN13.4 161.29,60.96 v158.75,58.42
  Bottom 0.254: v158.75,58.42 153.03,58.42 ADDRESS0.J
!DA10-1
  Top 0.254: 128.91,59.05 131.44,56.52 IC11.6 | 128.91,59.05 127.64,60.33 RN15.4 | 128.91,59.05 128.91,64.77 125.73,64.77 123.83,62.87 123.83,58.42 117.47,58.42 ADDRESS1.J
!DA10-2  (via drill 0.61)
  Top 0.254: v98.42,44.45 98.42,53.98 97.16,55.24 IC9.6 | v93.34,44.45 93.34,59.05 92.08,60.33 RN17.4 90.81,60.33 89.53,59.05 89.53,58.42 81.92,58.42 ADDRESS2.J
  Bottom 0.254: v93.34,44.45 v98.42,44.45
!DA10-3
  Bottom 0.254: 44.45,59.05 44.45,61.59 45.09,62.23 53.34,62.23 54.61,60.96 RN19.4 | 44.45,59.05 45.72,59.05 ADDRESS3.J | 44.45,59.05 44.45,55.24 45.09,54.61 46.35,54.61 48.9,57.15 57.15,57.15 57.78,56.52 59.05,56.52 59.69,55.88 IC7.6
!DA11  (via drill 0.61)
  Top 0.254: v201.93,50.8 201.93,43.18 198.12,39.37 IC15.15
  Bottom 0.254: v201.93,50.8 203.2,52.07 216.53,52.07 217.81,53.34 ADDRESS.N
!DA11-0  (via drill 0.61)
  Top 0.254: 172.72,46.99 172.72,50.8 168.91,54.61 165.1,54.61 163.83,55.88 RN13.6 | 172.72,46.99 172.72,30.48 174.62,28.57 IC12.17 | v156.21,53.34 158.12,51.44 158.12,45.72 159.38,44.45 165.74,44.45 165.74,46.35 166.37,46.99 172.72,46.99
  Bottom 0.254: v156.21,53.34 153.03,53.34 ADDRESS0.N
!DA11-1
  Top 0.254: 135.89,36.83 135.89,40.64 134.62,41.91 134.62,53.34 133.35,54.61 129.54,54.61 128.27,55.88 RN15.6 | 135.89,36.83 135.89,21.59 140.97,21.59 141.6,22.23 141.6,26.04 140.34,27.3 IC10.17 | 135.89,36.83 125.73,36.83 125.09,37.47 125.09,44.45 116.2,44.45 115.57,45.09 115.57,51.44 116.84,52.7 ADDRESS1.N
!DA11-2  (via drill 0.61)
  Top 0.254: v83.19,55.88 81.92,57.15 80.01,57.15 80.01,55.24 81.28,53.98 ADDRESS2.N | v99.69,27.94 99.06,28.57 v99.06,36.83 | v88.9,36.83 88.9,53.34 90.81,55.24 RN17.6
  Bottom 0.254: v83.19,55.88 90.17,55.88 RN17.6 | v99.69,27.94 102.87,27.94 IC8.17 | v88.9,36.83 v99.06,36.83
!DA11-3  (via drill 0.61)
  Top 0.254: v66.04,54.61 66.04,30.48 67.94,28.57 IC6.17
  Bottom 0.254: v66.04,54.61 59.05,54.61 57.78,55.88 57.15,55.88 RN19.6 54.61,55.88 48.9,55.88 46.35,53.34 ADDRESS3.N
!DAEX0  (via drill 0.61)
  Top 0.254: v26.67,76.2 29.21,76.2 v29.21,69.85 | v111.76,71.75 120.02,71.75 v120.02,73.66 | v209.55,78.11 219.71,88.27 219.71,92.08 218.44,93.34 DATA.RR
  Bottom 0.254: v26.67,76.2 22.86,76.2 18.41,80.64 IC5.7 | v29.21,69.85 29.84,70.48 57.78,70.48 61.59,74.3 92.71,74.3 94.61,72.39 111.12,72.39 v111.76,71.75 | v120.02,73.66 124.46,78.11 v209.55,78.11
!DAEX0-0  (via drill 0.61)
  Top 0.254: v170.18,87 170.18,85.09 170.81,84.45 170.81,55.24 174.62,51.44 IC13.13 | v156.21,93.98 157.48,92.71 v157.48,88.9
  Bottom 0.254: v170.18,87 169.54,87.63 165.1,87.63 163.83,88.9 RN2.9 161.29,88.9 v157.48,88.9 | v156.21,93.98 153.03,93.98 DATA0.RR
!DAEX0-1  (via drill 0.61)
  Top 0.254: v135.25,88.9 135.25,83.19 137.16,81.28 137.16,53.34 139.06,51.44 IC11.13 | v120.02,88.9 120.02,90.17 116.84,93.34 DATA1.RR
  Bottom 0.254: v135.25,88.9 134.62,89.53 133.99,89.53 133.35,90.17 130.81,90.17 129.54,88.9 128.27,88.9 RN6.9 125.73,88.9 v120.02,88.9
!DAEX0-2  (via drill 0.61)
  Top 0.254: v100.97,88.9 100.97,81.92 100.33,81.28 100.33,70.48 101.6,69.22 101.6,53.34 103.5,51.44 IC9.13 | v84.45,93.98 85.09,93.34 v85.09,88.9
  Bottom 0.254: v100.97,88.9 99.69,90.17 94.61,90.17 93.34,88.9 92.71,88.9 RN8.9 90.17,88.9 v85.09,88.9 | v84.45,93.98 81.92,93.98 DATA2.RR
!DAEX0-3  (via drill 0.61)
  Top 0.254: v64.77,87 65.41,86.36 65.41,56.52 67.31,54.61 66.67,53.98 66.67,52.7 67.94,51.44 IC7.13
  Bottom 0.254: v64.77,87 64.14,87.63 58.42,87.63 57.15,88.9 RN10.9 54.61,88.9 51.44,88.9 46.35,93.98 DATA3.RR
!DAEX1
  Top 0.254: IC5.15 30.48,74.93 31.75,76.2 31.75,87.63 29.21,90.17 29.21,148.59 34.29,153.67 34.29,186.69 38.1,190.5 48.9,190.5 48.9,194.94 55.88,201.93 217.17,201.93 217.17,142.88 220.98,139.06 220.98,102.23 218.44,99.69 DATA.LL
!DAEX1-0  (via drill 0.61)
  Top 0.254: v160.66,87.63 160.66,92.08 161.93,93.34 RN2.7 | DATA0.LL 152.4,98.42 153.67,97.16 v153.67,87.63 v153.67,76.2
  Bottom 0.254: v153.67,87.63 v160.66,87.63 | v153.67,76.2 194.31,76.2 194.31,62.23 189.87,57.78 178.44,57.78 176.53,55.88 IC13.15
!DAEX1-1  (via drill 0.61)
  Top 0.254: v145.41,55.88 144.78,56.52 v144.78,93.98 | v120.02,93.98 120.02,95.25 116.84,98.42 DATA1.LL
  Bottom 0.254: v145.41,55.88 140.97,55.88 IC11.15 | v144.78,93.98 144.15,93.34 141.6,93.34 140.97,92.71 137.16,92.71 135.25,94.61 133.99,94.61 133.35,95.25 130.18,95.25 128.91,93.98 128.27,93.98 RN6.7 125.73,93.98 v120.02,93.98
!DAEX1-2  (via drill 0.61)
  Top 0.254: v100.33,93.98 100.33,92.71 105.41,92.71 106.05,92.08 106.05,83.19 101.6,78.74 101.6,70.48 102.23,69.85 102.23,57.78 103.5,56.52 IC9.15 | v88.27,93.98 87,92.71 87,81.28 83.19,81.28 80.01,84.45 80.01,97.16 81.28,98.42 DATA2.LL
  Bottom 0.254: v100.33,93.98 99.69,94.61 98.42,94.61 97.79,95.25 95.25,95.25 93.98,93.98 92.71,93.98 RN8.7 90.17,93.98 v88.27,93.98
!DAEX1-3  (via drill 0.61)
  Top 0.254: v64.77,91.44 66.04,90.17 66.04,58.42 67.94,56.52 IC7.15
  Bottom 0.254: v64.77,91.44 63.5,92.71 58.42,92.71 57.15,93.98 RN10.7 54.61,93.98 53.34,95.25 44.45,95.25 44.45,97.16 45.72,98.42 DATA3.LL
!DAEX2  (via drill 0.61)
  Top 0.254: v22.23,143.51 22.23,105.41 26.67,105.41 27.3,104.78 27.3,85.72 30.48,82.55 IC5.2 | v184.78,146.69 201.93,146.69 201.93,130.81 214.63,118.11 214.63,88.27 215.26,87.63 217.17,87.63 217.17,102.23 218.44,103.5 DATA.FF
  Bottom 0.254: v22.23,143.51 24.77,146.05 106.05,146.05 113.67,153.67 120.02,153.67 127,146.69 v184.78,146.69
!DAEX2-0  (via drill 0.61)
  Top 0.254: v169.54,62.23 169.54,69.85 168.28,69.85 158.75,79.38 158.75,88.9 158.12,89.53 158.12,91.44 159.38,92.71 159.38,95.89 161.93,98.42 RN2.5 | v151.13,107.95 151.13,106.05 152.4,104.78 DATA0.FF | v156.21,107.95 158.75,105.41 v158.75,99.06
  Bottom 0.254: v169.54,62.23 170.81,60.96 173.99,60.96 IC13.17 | v151.13,107.95 v156.21,107.95 | v158.75,99.06 161.29,99.06 RN2.5
!DAEX2-1  (via drill 0.61)
  Top 0.254: v122.56,99.06 117.47,104.14 DATA1.FF | v135.89,60.96 134.62,62.23 134.62,86.36 133.35,87.63 130.18,87.63 130.18,97.16 130.81,97.79 134.62,97.79 v134.62,99.06
  Bottom 0.254: v122.56,99.06 125.73,99.06 RN6.5 128.27,99.06 128.91,99.06 130.18,100.33 133.35,100.33 v134.62,99.06 | v135.89,60.96 138.43,60.96 IC11.17
!DAEX2-2  (via drill 0.61)
  Top 0.254: v85.09,99.06 82.55,101.6 82.55,102.23 81.28,103.5 DATA2.FF | v100.33,60.96 99.69,61.59 99.69,81.92 100.33,82.55 100.33,88.27 99.06,89.53 v99.06,99.06
  Bottom 0.254: v85.09,99.06 90.17,99.06 RN8.5 92.71,99.06 93.34,99.06 94.61,100.33 97.79,100.33 v99.06,99.06 | v100.33,60.96 102.87,60.96 IC9.17
!DAEX2-3  (via drill 0.61)
  Top 0.254: v64.14,60.96 63.5,61.59 v63.5,97.79 | v44.45,100.33 44.45,102.23 45.72,103.5 DATA3.FF
  Bottom 0.254: v64.14,60.96 67.31,60.96 IC7.17 | v63.5,97.79 58.42,97.79 57.15,99.06 RN10.5 54.61,99.06 50.8,99.06 49.53,100.33 v44.45,100.33
!DATA_OUT  (via drill 0.61)
  Top 0.254: v36.83,187.96 v36.83,138.43
  Bottom 0.254: v36.83,138.43 27.94,138.43 26.67,137.16 IC19.2 | v36.83,187.96 36.83,201.93 208.28,201.93 227.33,182.88 227.33,43.81 218.44,43.81 ADDRESS.X
!DATA_OUT0  (via drill 0.61)
  Top 0.254: v179.07,120.65 178.44,120.02 178.44,99.69 176.53,97.79 173.35,97.79 173.35,95.89 173.99,95.25 180.34,95.25 180.34,68.58 178.44,66.67 v178.44,46.99
  Bottom 0.254: 177.16,46.35 176.53,46.99 166.37,46.99 165.74,46.35 164.47,46.35 163.83,45.72 RN13.10 | 177.16,46.35 177.16,43.81 154.31,43.81 153.67,43.18 153.03,43.18 ADDRESS0.X | v179.07,120.65 177.8,120.65 176.53,121.92 IC27.13 | v178.44,46.99 177.8,46.35 177.16,46.35
!DATA_OUT1  (via drill 0.61)
  Top 0.254: v144.78,121.92 146.69,120.02 v146.69,45.72
  Bottom 0.254: 124.46,44.45 123.19,43.18 117.47,43.18 ADDRESS1.X | 124.46,44.45 125.73,45.72 RN15.10 | v144.78,121.92 140.97,121.92 IC25.13 | v146.69,45.72 145.41,44.45 124.46,44.45
!DATA_OUT2  (via drill 0.61)
  Top 0.254: v109.86,45.72 v109.86,121.92
  Bottom 0.254: ADDRESS2.X 81.92,43.18 83.19,44.45 88.9,44.45 90.17,45.72 RN17.10 92.71,45.72 93.34,45.72 94.61,46.99 97.79,46.99 100.33,44.45 108.58,44.45 v109.86,45.72 | v109.86,121.92 105.41,121.92 IC23.13
!DATA_OUT3  (via drill 0.61)
  Top 0.254: v53.98,130.81 57.78,130.81 57.78,83.19 53.34,78.74 53.34,48.26 55.24,46.35 RN19.10
  Bottom 0.254: RN19.10 54.61,45.72 53.98,45.09 48.26,45.09 46.35,43.18 ADDRESS3.X | v53.98,130.81 57.15,130.81 59.69,128.27 62.23,128.27 67.94,122.56 IC21.13
!DB0
  Bottom 0.254: IC30.15 198.75,131.44 200.03,130.18 214.63,130.18 215.26,130.81 216.53,130.81 217.81,132.08 DATA.F
!DB0-0
  Top 0.254: IC27.4 166.37,132.08 163.83,134.62 RN1.3
  Bottom 0.254: DATA0.F 153.03,132.08 154.31,133.35 160.02,133.35 161.29,134.62 RN1.3
!DB0-1
  Bottom 0.254: IC25.4 130.81,132.08 128.27,134.62 RN5.3 125.73,134.62 120.02,134.62 117.47,132.08 DATA1.F
!DB0-2
  Bottom 0.254: 94.61,132.72 92.71,134.62 RN7.3 | 94.61,132.72 95.25,132.08 IC23.4 | 94.61,132.72 92.71,130.81 83.19,130.81 81.92,132.08 DATA2.F
!DB0-3
  Bottom 0.254: IC21.4 59.69,132.08 57.15,134.62 RN9.3 54.61,134.62 48.9,134.62 46.35,132.08 DATA3.F
!DB1
  Bottom 0.254: IC30.9 183.51,131.44 186.69,128.27 216.53,128.27 217.81,127 DATA.L
!DB1-0
  Top 0.254: IC27.8 167,122.56 165.74,123.83 165.74,131.44 163.83,133.35 160.66,133.35 160.66,131.44 161.93,130.18 RN1.5
  Bottom 0.254: DATA0.L 153.03,127 154.31,128.27 157.48,128.27 158.75,129.54 161.29,129.54 RN1.5
!DB1-1  (via drill 0.61)
  Top 0.254: v133.99,114.3 133.99,120.02 132.72,121.28 IC25.8 | v128.27,114.94 128.91,115.57 128.91,127.64 127.64,128.91 RN5.5
  Bottom 0.254: v133.99,114.3 133.35,114.94 v128.27,114.94 | DATA1.L 117.47,127 120.02,129.54 125.73,129.54 RN5.5
!DB1-2  (via drill 0.61)
  Top 0.254: 89.53,129.54 85.09,129.54 v85.09,127 | 89.53,129.54 90.17,129.54 RN7.5 | v99.06,114.3 99.06,119.38 97.16,121.28 IC23.8 | v90.81,114.94 89.53,116.2 89.53,129.54
  Bottom 0.254: v85.09,127 81.92,127 DATA2.L | v99.06,114.3 98.42,114.94 v90.81,114.94
!DB1-3  (via drill 0.61)
  Top 0.254: v49.53,126.36 49.53,129.54 54.61,129.54 RN9.5
  Bottom 0.254: IC21.8 59.69,121.92 58.42,123.19 48.9,123.19 46.35,120.65 45.09,120.65 44.45,121.28 44.45,127 45.09,127 DATA3.L 46.35,127 48.9,127 v49.53,126.36
!DB2  (via drill 0.61)
  Top 0.254: v201.93,120.65 198.75,117.47 IC29.2
  Bottom 0.254: v201.93,120.65 216.53,120.65 217.81,121.92 DATA.R
!DB2-0  (via drill 0.61)
  Top 0.254: v172.72,111.76 172.72,95.25 173.99,93.98 IC26.15 | v163.83,114.94 164.47,115.57 164.47,122.56 163.19,123.83 RN1.7 161.29,124.46 v158.75,121.92
  Bottom 0.254: v172.72,111.76 169.54,114.94 v163.83,114.94 | v158.75,121.92 153.03,121.92 DATA0.R
!DB2-1  (via drill 0.61)
  Top 0.254: RN5.7 125.73,124.46 v123.19,121.92 123.19,116.84 v128.27,111.76 | v137.16,107.31 137.16,96.52 139.06,94.61 IC24.15
  Bottom 0.254: v123.19,121.92 117.47,121.92 DATA1.R | v137.16,107.31 132.72,111.76 v128.27,111.76
!DB2-2  (via drill 0.61)
  Top 0.254: v101.6,120.65 101.6,96.52 103.5,94.61 IC22.15 | v88.27,124.46 v88.27,121.92
  Bottom 0.254: v101.6,120.65 99.06,123.19 93.98,123.19 92.71,124.46 RN7.7 90.17,124.46 v88.27,124.46 | v88.27,121.92 81.92,121.92 DATA2.R
!DB2-3  (via drill 0.61)
  Top 0.254: v66.04,119.38 66.04,114.3 65.41,113.67 65.41,97.16 67.94,94.61 IC20.15
  Bottom 0.254: v66.04,119.38 62.23,123.19 59.69,123.19 58.42,124.46 57.15,124.46 RN9.7 55.24,123.83 48.26,123.83 46.35,121.92 DATA3.R
!DB3  (via drill 0.61)
  Top 0.254: v189.23,120.02 189.23,115.57 183.51,109.86 IC29.9
  Bottom 0.254: v189.23,120.02 189.87,119.38 214,119.38 215.26,118.11 216.53,118.11 217.81,116.84 DATA.V
!DB3-0  (via drill 0.61)
  Top 0.254: 160.66,116.84 160.66,117.47 161.93,118.75 RN1.9 | 160.66,116.84 160.66,116.2 164.47,112.39 164.47,107.31 167,104.78 IC26.2 | v160.02,116.84 160.66,116.84
  Bottom 0.254: v160.02,116.84 153.03,116.84 DATA0.V
!DB3-1  (via drill 0.61)
  Top 0.254: v134.62,106.68 132.72,104.78 IC24.2 | v124.46,116.84 126.36,118.75 RN5.9
  Bottom 0.254: v134.62,106.68 133.35,107.95 132.72,107.95 130.81,109.86 130.18,109.86 128.27,107.95 122.56,107.95 117.47,113.03 116.2,113.03 115.57,113.67 115.57,116.84 116.2,116.84 DATA1.V 117.47,116.84 v124.46,116.84
!DB3-2  (via drill 0.61)
  Top 0.254: v100.33,108.58 v100.33,104.14 | v85.72,119.38 84.45,118.11 v84.45,116.84
  Bottom 0.254: v100.33,104.14 97.79,104.14 IC22.2 | v100.33,108.58 98.42,110.49 84.45,110.49 81.92,113.03 80.64,113.03 80.01,113.67 80.01,116.84 80.64,116.84 DATA2.V 81.92,116.84 v84.45,116.84 | v85.72,119.38 90.17,119.38 RN7.9
!DB3-3  (via drill 0.61)
  Top 0.254: v63.5,119.38 63.5,106.68 61.59,104.78 IC20.2
  Bottom 0.254: v63.5,119.38 62.23,120.65 58.42,120.65 57.15,119.38 RN9.9 55.24,118.75 48.26,118.75 46.35,116.84 DATA3.V
!DB4
  Bottom 0.254: IC29.7 186.06,116.2 189.23,113.03 216.53,113.03 217.81,111.76 DATA.Z
!DB4-0
  Top 0.254: IC26.4 167,99.69 164.47,102.23 164.47,104.78 163.19,106.05 RN2.2
  Bottom 0.254: DATA0.Z 153.03,111.76 155.57,109.22 158.75,109.22 161.29,106.68 RN2.2
!DB4-1  (via drill 0.61)
  Top 0.254: v130.81,108.58 130.18,107.95 130.18,100.97 131.44,99.69 IC24.4
  Bottom 0.254: v130.81,108.58 128.91,106.68 128.27,106.68 RN6.2 125.73,106.68 122.56,106.68 117.47,111.76 DATA1.Z
!DB4-2  (via drill 0.61)
  Top 0.254: v99.06,106.68 99.06,101.6 97.16,99.69 IC22.4
  Bottom 0.254: v99.06,106.68 97.79,107.95 93.98,107.95 92.71,106.68 RN8.2 90.17,106.68 87,109.86 83.82,109.86 81.92,111.76 DATA2.Z
!DB4-3  (via drill 0.61)
  Top 0.254: v59.69,108.58 59.05,107.95 59.05,100.97 60.33,99.69 IC20.4 | v49.53,106.68 49.53,107.31 45.72,111.12 DATA3.Z
  Bottom 0.254: v59.69,108.58 57.78,106.68 57.15,106.68 RN10.2 54.61,106.68 v49.53,106.68
!DB5
  Bottom 0.254: IC28.15 198.75,84.45 203.2,88.9 214,88.9 215.26,90.17 219.07,90.17 219.71,90.81 219.71,106.05 218.44,106.05 DATA.DD
!DB5-0  (via drill 0.61)
  Top 0.254: IC26.6 168.28,94.61 169.54,95.89 v169.54,105.41 169.54,107.31 168.91,107.95 165.1,107.95 165.1,129.54 163.19,131.44 RN1.4
  Bottom 0.254: v169.54,105.41 154.31,105.41 153.03,106.68 DATA0.DD
!DB5-1  (via drill 0.61)
  Top 0.254: 123.19,139.7 124.46,138.43 124.46,134.62 126.36,132.72 RN5.4 | 123.19,139.7 115.57,139.7 115.57,111.12 116.2,110.49 118.11,110.49 118.11,108.58 116.84,107.31 DATA1.DD | v135.25,140.97 135.25,120.02 135.89,119.38 135.89,97.79 132.72,94.61 IC24.6 | v124.46,140.97 123.19,139.7
  Bottom 0.254: v135.25,140.97 v124.46,140.97
!DB5-2  (via drill 0.61)
  Top 0.254: v97.79,77.47 97.79,82.55 98.42,83.19 98.42,92.08 97.16,93.34 IC22.6 | v74.3,77.47 v74.3,106.68 | v82.55,133.35 82.55,108.58 81.28,107.31 DATA2.DD
  Bottom 0.254: v74.3,77.47 v97.79,77.47 | v74.3,106.68 75.56,107.95 79.38,107.95 80.64,106.68 DATA2.DD | v82.55,133.35 88.9,133.35 90.17,132.08 RN7.4
!DB5-3  (via drill 0.61)
  Top 0.254: v71.75,106.68 71.75,92.71 67.31,92.71 64.77,95.25 64.77,99.06 63.5,99.06 62.23,97.79 62.87,97.16 62.87,95.89 61.59,94.61 IC20.6 | RN9.4 54.61,132.08 46.99,132.08 46.99,131.44 46.35,130.81 44.45,130.81 44.45,108.58 45.72,107.31 DATA3.DD
  Bottom 0.254: v71.75,106.68 70.48,107.95 61.59,107.95 59.69,109.86 59.05,109.86 57.15,107.95 47.62,107.95 46.35,106.68 DATA3.DD
!DB6  (via drill 0.61)
  Top 0.254: v204.47,97.79 198.75,92.08 IC28.2
  Bottom 0.254: v204.47,97.79 207.01,100.33 216.53,100.33 217.81,101.6 DATA.JJ
!DB6-0  (via drill 0.61)
  Top 0.254: v170.18,88.27 169.54,87.63 166.37,87.63 165.1,88.9 165.1,93.98 163.19,95.89 RN2.6 | v156.21,101.6 157.48,100.33 v157.48,96.52
  Bottom 0.254: v170.18,88.27 170.81,88.9 173.99,88.9 IC26.13 | v156.21,101.6 153.03,101.6 DATA0.JJ | v157.48,96.52 161.29,96.52 RN2.6
!DB6-1  (via drill 0.61)